# Altium schematic sheet Analog_Front_End_Characterisation.SchDoc: Analog Front End Characterisation
size A4; DrawnBy: T. Barrett; SheetNumber: 3; SheetTotal: 3
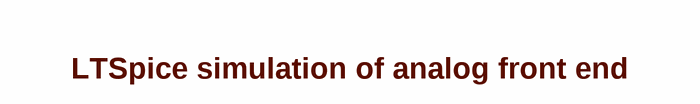
[diagram p0: Analog_Front_End_Characterisation.SchDoc]

## Notes on the sheet
- LTSpice simulation of analog front end
- Sheet Title:
- Drawn By:
- Project:
- Size:
- A4
- Sheet:
- of
- University of Sussex
- File:
- Rev.
- Date: